# EasyEDA Pro project ST_Link_v2.1.eprj

# Schematic Schematic1
Create Date: 2023-06-13; Page Name: P1; Project Name: ST_Link_v2.1; Schematic Name: Schematic1; Update Date: 2023-06-21; Company: 嘉立创EDA; Page Size: A4; Version: V1.0
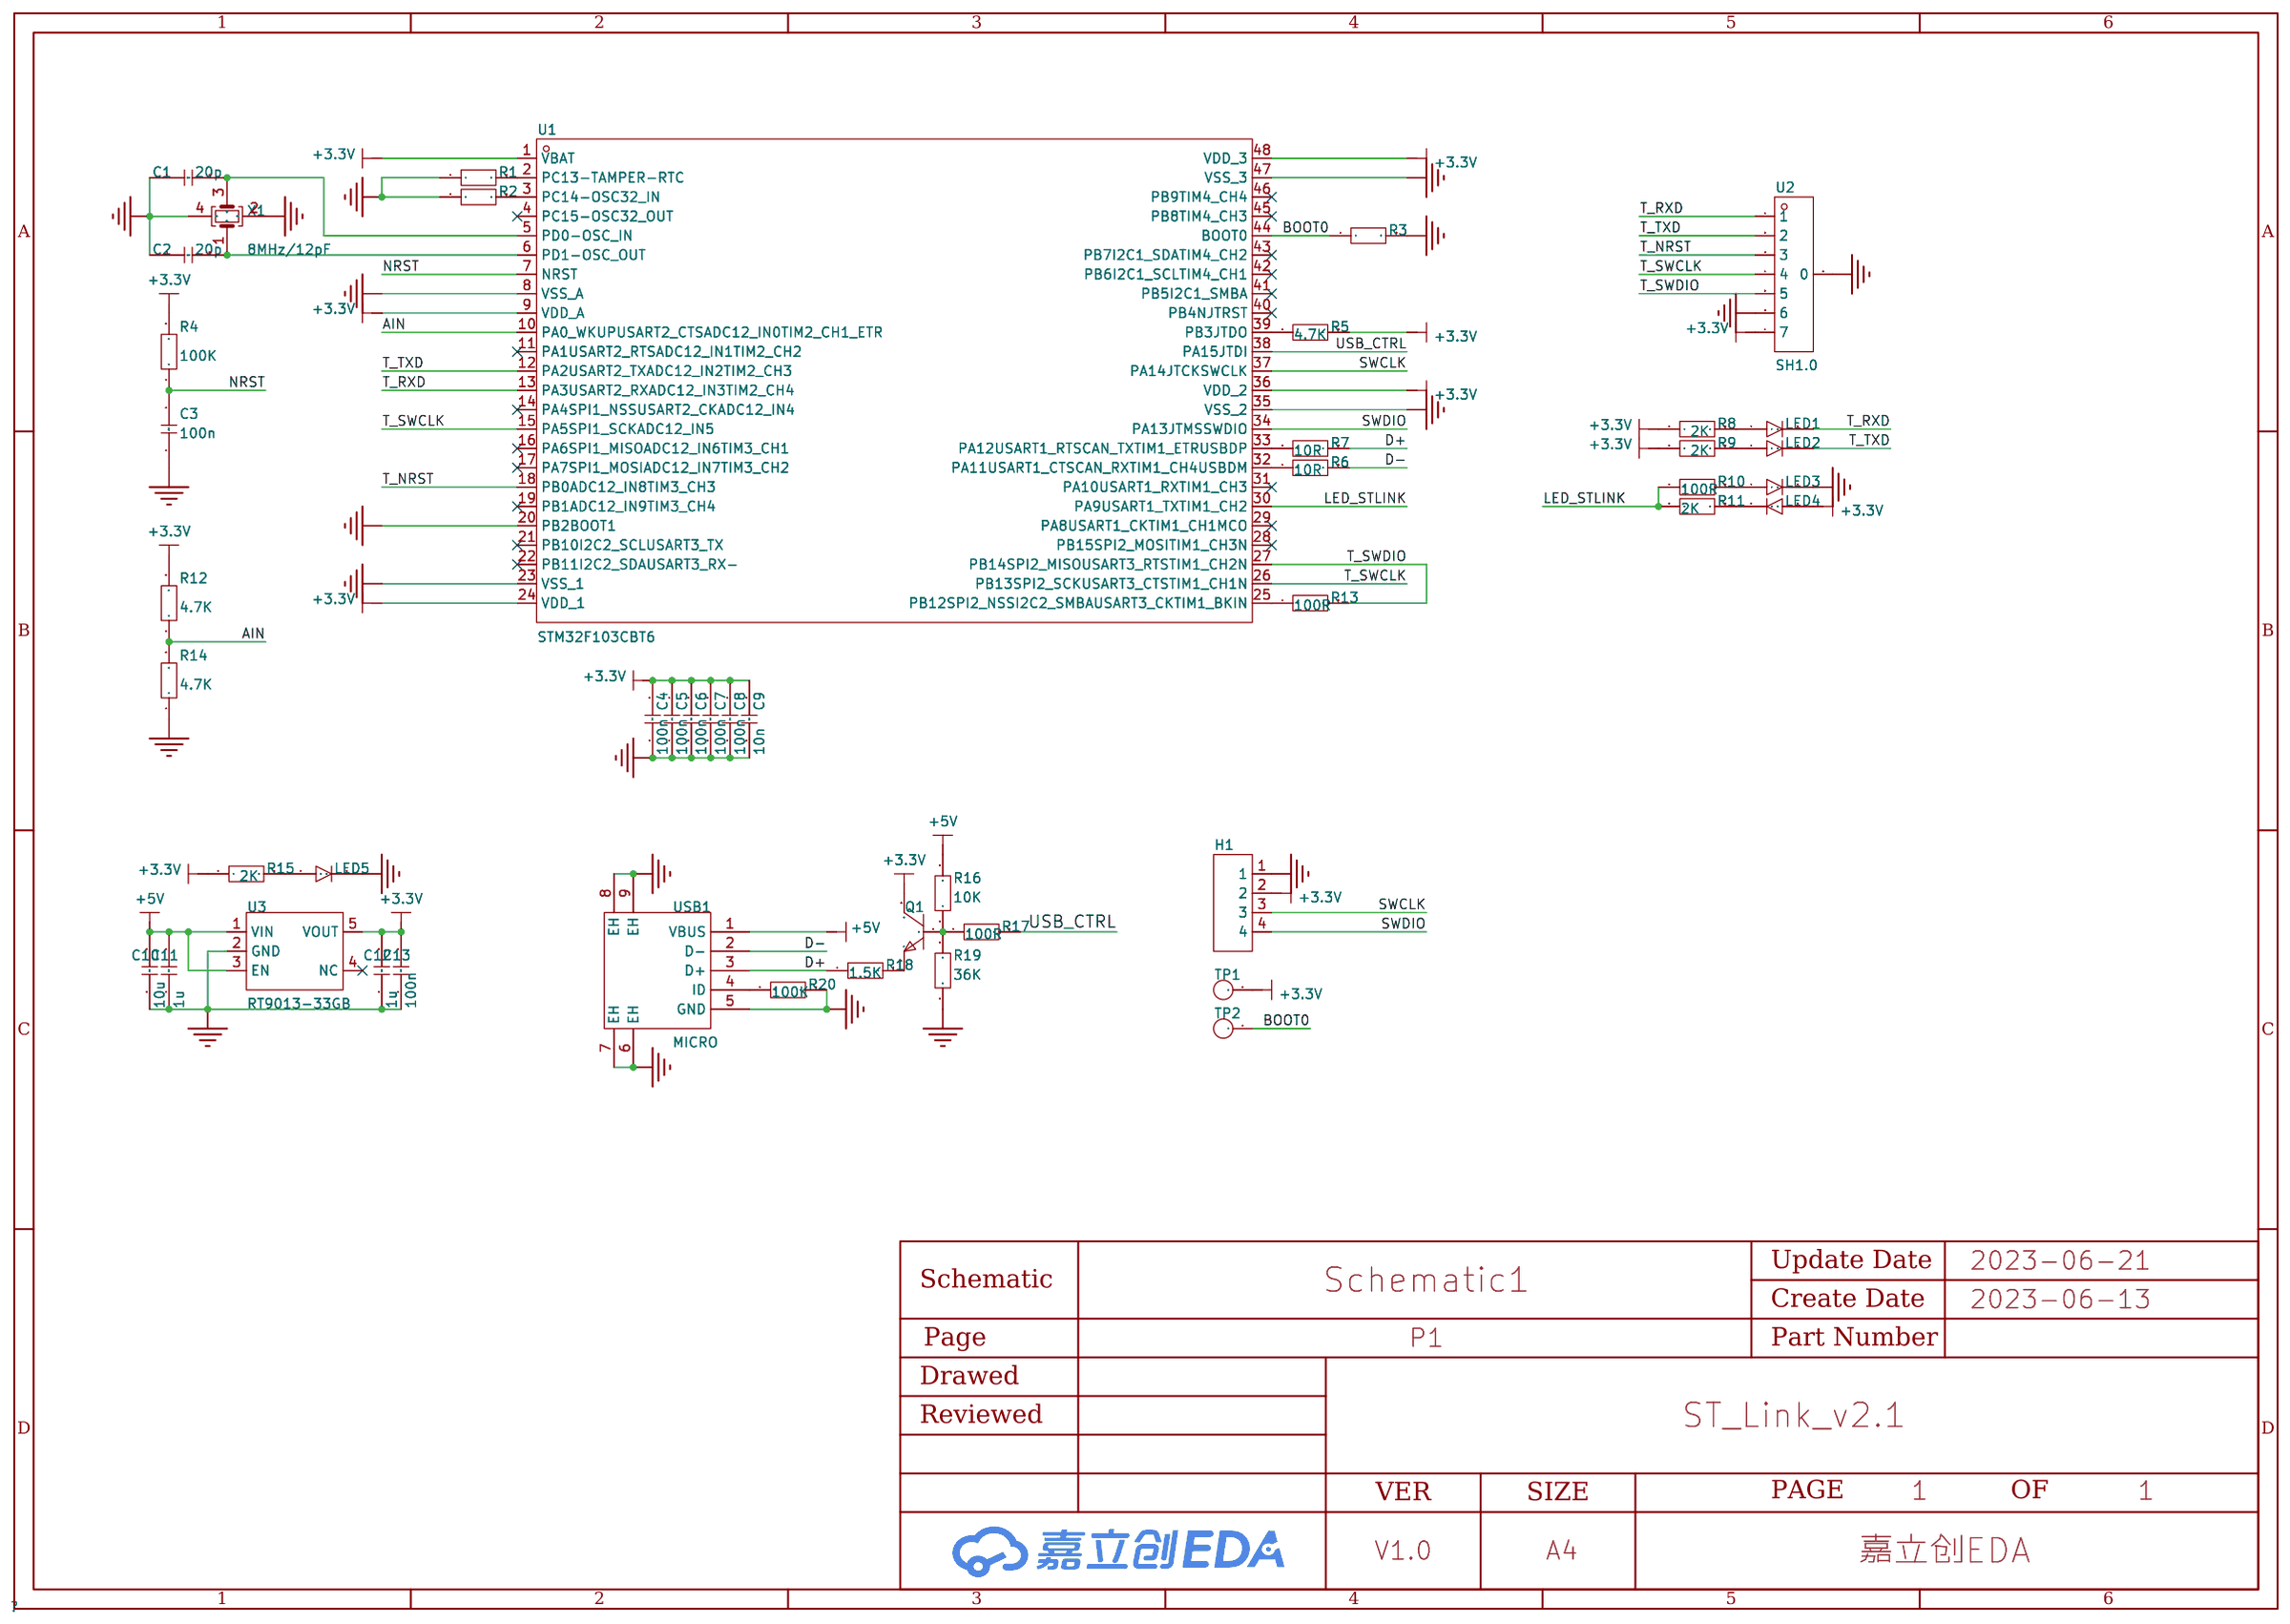
[diagram p0: schematic sheet]

## Parts
C1  20p  [C0402]
C2  20p  [C0402]
C3  100n  [C0402]
C4  100n  [C0402]
C5  100n  [C0402]
C6  100n  [C0402]
C7  100n  [C0402]
C8  100n  [C0402]
C9  10n  [C0402]
C10  10u  [C0402]
C11  1u  [C0402]
C12  1u  [C0402]
C13  100n  [C0402]
H1  -  [PIN_1.27_1x4]
LED1  red  [LED0402]
LED2  green  [LED0402]
LED3  red  [LED0402]
LED4  green  [LED0402]
LED5  red  [LED0402]
Q1  -  [S8050_SOT-23]
R1  10K  [R0402]
R2  10K  [R0402]
R3  10K  [R0402]
R4  100K  [R0402]
R5  4.7K  [R0402]
R6  10R  [R0402]
R7  10R  [R0402]
R8  2K  [R0402]
R9  2K  [R0402]
R10  100R  [R0402]
R11  2K  [R0402]
R12  4.7K  [R0402]
R13  100R  [R0402]
R14  4.7K  [R0402]
R15  2K  [R0402]
R16  10K  [R0402]
R17  100R  [R0402]
R18  1.5K  [R0402]
R19  36K  [R0402]
R20  100K  [R0402]
TP1  -  [TP-1.27]
TP2  -  [TP-1.27]
U1  STM32F103CBT6  [LQFP-48_L7.0-W7.0-P0.50-LS9.0-BL]
U2  SH1.0  [CONN-SMD_7P-SH1.00-7P-WT]
U3  RT9013-33GB  [SOT-23-5_L3.0-W1.7-P0.95-LS2.8-BL]
USB1  MICRO  [MICRO-USB-SMD_KH-MICRO-SMT.J7.2-5P]
X1  8MHz/12pF  [OSC-SMD_4P-L3.2-W2.5-BL]

## Library data of the parts
C1-C13 = C0402
H1 = PIN_1.27_1x4
LED1 LED3 LED5 = LED-R-0402
LED2 LED4 = LED-G-0402
Q1 = S8050_SOT_NPN: Supplier Footprint: SOT-23
R1-R20 = R0402
TP1 TP2 = TP-1.27: JLCPCB Part Class: 扩展库
U1 = STM32F103CBT6: LCSC Part Name: ARM Cortex-M3 72MHz; Supplier Part: C8304; Manufacturer: ST(意法半导体); Supplier Footprint: LQFP-48(7x7); JLCPCB Part Class: 扩展库; Datasheet: https://atta.szlcsc.com/upload/public/pdf/source/20140724/1457707170379.pdf; Supplier: LCSC; CPU Core: ARM Cortex-M3; CPU Maximum Speed: 72MHz; Operating Voltage Range: 2V~3.6V; Program Storage Size: 128KB; Program Memory Type: FLASH; RAM Size: 20KB; GPIO Ports Number: 37; ADC (Bit): 12bit; Universal Serial Bus: 有; Peripheral/Function: DMA；片载温度传感器；PWM; Watchdog: 有; Infrared Data Association: 有; Low-Voltage Detect: 有; Direct Memory Access: 有; Internal Oscillator: 有; Operating Temperature Range: -40℃~+85℃
U2 = SH1.0_7P
U3 = RT9013-33GB: 输出类型:固定;输出极性:正;最大输入电压:5.5V;输出电压:3.3V;输出电流:500mA;电源纹波抑制比(PSRR):50dB@(10kHz);; Supplier Part: C47773; Manufacturer: RICHTEK(立锜); Supplier Footprint: SOT-23-5; JLCPCB Part Class: 扩展库; Datasheet: https://atta.szlcsc.com/upload/public/pdf/source/20150504/1457707282459.pdf; Supplier: LCSC; Output Type: 固定; Output Polarity: 正; Number of Outputs: 1; Maximum Input Voltage: 5.5V; Output Voltage: 3.3V; Dropout Voltage: 400mV@(500mA); Output Current: 500mA; Power Supply Rejection Ratio (PSRR): 50dB@(10kHz)
USB1 = KH-MICRO-SMT.J7.2-5P: 连接器类型:Micro-B;标准:USB 2.0;公母:母座;触点数量:5;端口数量:1;安装方式:卧贴;额定电流 - 电源:1A;工作温度范围:-30℃~+80℃;; LCSC Part Name: Micro-B 母座 卧贴; Supplier Part: C2688801; Manufacturer: kinghelm(金航标); Supplier Footprint: SMD; JLCPCB Part Class: 扩展库; Datasheet: https://atta.szlcsc.com/upload/public/pdf/source/20210202/C2688801_229287E4F6FB01E5C7708C9D4F7A0145.pdf; Supplier: LCSC; Connector Type: Micro-B; Standard: USB 2.0; Gender: 母座; Number of Contacts: 5; Number of Ports: 1; Mounting Style: 卧贴; Current Rating - Power (Max): 1A; Operating Temperature Range: -30℃~+80℃
X1 = OSC3225: LCSC Part Name: 16MHz ±10ppm 9pF YSX321SL; Supplier Part: C13738; Manufacturer: YXC(扬兴晶振); Manufacturer Part: X322516MLB4SI; Supplier Footprint: SMD3225-4P; JLCPCB Part Class: 基础库; Datasheet: https://atta.szlcsc.com/upload/public/pdf/source/20210329/C112971_1F611BDC486E193C1706F6D8EB5AA189.pdf; Supplier: LCSC; Crystal Type: 贴片无源晶振; Frequency Tolerance: ±10ppm; Frequency Stability: ±30ppm; Load Capacitance: 9pF; Operating Temperature: -40℃~+85℃

## Nets
+3.3V: C4.2 C5.2 C6.2 C7.2 C8.2 C9.2 C12.2 C13.2 H1.2 LED4.1 Q1.3 R4.2 R5.2 R8.1 R9.1 R12.2 R15.1 TP1.1 U1.1(VBAT) U1.9(VDD_A) U1.24(VDD_1) U1.36(VDD_2) U1.48(VDD_3) U2.7 U3.5(VOUT)
+5V: C10.2 C11.2 R16.2 U3.1(VIN) U3.3(EN) USB1.1(VBUS)
GND: C1.1 C2.1 C3.1 C4.1 C5.1 C6.1 C7.1 C8.1 C9.1 C10.1 C11.1 C12.1 C13.1 H1.1 LED3.2 LED5.2 R1.1 R2.1 R3.2 R14.1 R19.1 R20.2 U1.8(VSS_A) U1.20(PB2BOOT1) U1.23(VSS_1) U1.35(VSS_2) U1.47(VSS_3) U2.0 U2.6 U3.2(GND) USB1.5(GND) USB1.6(EH) USB1.7(EH) USB1.8(EH) USB1.9(EH) X1.2(GND) X1.4(GND)
AIN: R12.1 R14.2 U1.10(PA0_WKUPUSART2_CTSADC12_IN0TIM2_CH1_ETR)
BOOT0: R3.1 TP2.1 U1.44(BOOT0)
D+: R7.2 R18.1 USB1.3(D+)
D-: R6.2 USB1.2(D-)
LED_STLINK: R10.1 R11.1 U1.30(PA9USART1_TXTIM1_CH2)
NRST: C3.2 R4.1 U1.7(NRST)
SWCLK: H1.3 U1.37(PA14JTCKSWCLK)
SWDIO: H1.4 U1.34(PA13JTMSSWDIO)
T_NRST: U1.18(PB0ADC12_IN8TIM3_CH3) U2.3
T_RXD: LED1.2 U1.13(PA3USART2_RXADC12_IN3TIM2_CH4) U2.1
T_SWCLK: U1.15(PA5SPI1_SCKADC12_IN5) U1.26(PB13SPI2_SCKUSART3_CTSTIM1_CH1N) U2.4
T_SWDIO: R13.2 U1.27(PB14SPI2_MISOUSART3_RTSTIM1_CH2N) U2.5
T_TXD: LED2.2 U1.12(PA2USART2_TXADC12_IN2TIM2_CH3) U2.2
USB_CTRL: R17.2 U1.38(PA15JTDI)
$1N2460: R1.2 U1.2(PC13-TAMPER-RTC)
$1N2527: R2.2 U1.3(PC14-OSC32_IN)
$1N4431: C1.2 U1.5(PD0-OSC_IN) X1.3(OSC2)
$1N4445: C2.2 U1.6(PD1-OSC_OUT) X1.1(OSC1)
$1N5071: R13.1 U1.25(PB12SPI2_NSSI2C2_SMBAUSART3_CKTIM1_BKIN)
$1N5297: R6.1 U1.32(PA11USART1_CTSCAN_RXTIM1_CH4USBDM)
$1N5356: R7.1 U1.33(PA12USART1_RTSCAN_TXTIM1_ETRUSBDP)
$1N6163: R5.1 U1.39(PB3JTDO)
$1N9264: Q1.2 R18.2
$1N9333: Q1.1 R16.1 R17.1 R19.2
$1N10341: R20.1 USB1.4(ID)
$1N11256: LED1.1 R8.2
$1N11591: LED5.1 R15.2
$1N16479: LED3.1 R10.2
$1N17806: LED4.2 R11.2
$1N18701: LED2.1 R9.2

Not connected (* = marked no-connect by the designer): U1 4(PC15-OSC32_OUT)* 11(PA1USART2_RTSADC12_IN1TIM2_CH2)* 14(PA4SPI1_NSSUSART2_CKADC12_IN4)* 16(PA6SPI1_MISOADC12_IN6TIM3_CH1)* 17(PA7SPI1_MOSIADC12_IN7TIM3_CH2)* 19(PB1ADC12_IN9TIM3_CH4)* 21(PB10I2C2_SCLUSART3_TX)* 22(PB11I2C2_SDAUSART3_RX-)* 28(PB15SPI2_MOSITIM1_CH3N)* 29(PA8USART1_CKTIM1_CH1MCO)* 31(PA10USART1_RXTIM1_CH3)* 40(PB4NJTRST)* 41(PB5I2C1_SMBA)* 42(PB6I2C1_SCLTIM4_CH1)* 43(PB7I2C1_SDATIM4_CH2)* 45(PB8TIM4_CH3)* 46(PB9TIM4_CH4)*; U3 4(NC)*

# Board PCB1
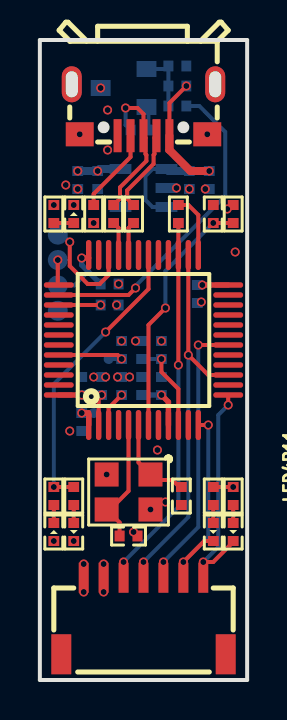
[diagram p1: board, top side]
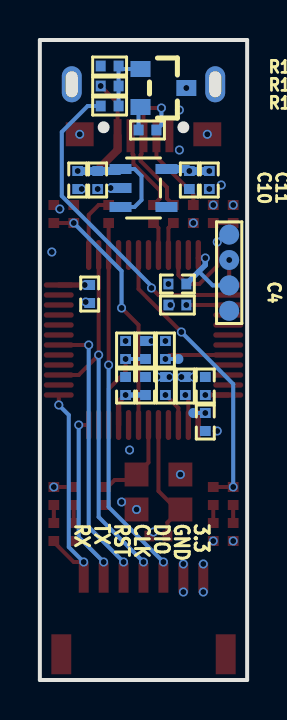
[diagram p2: board, bottom side, seen from below]

Outline 10.4 x 32 mm; copper layers: Top Layer, Inner1, Inner2, Bottom Layer. Coordinates in mm from the lower left corner of the outline.
Outline path: 0,32 10.4,32 10.4,0 0,0 0,32
Stack: Top Layer 0.035mm / Dielectric1 0.48mm PP er 4.5 / Inner1 0.035mm / Dielectric2 0.48mm FR4 er 4.5 / Inner2 0.035mm / Dielectric3 0.48mm PP er 4.5 / Bottom Layer 0.035mm

## Design rules (mm)
net D-: DP1
net D+: DP1
spacing safeClearance (default): track to track 0.152, other pairs 0.152 to 0.3
track width trackWidth (default): min 0.2, default 0.2, max 1
differential pair differentialPair (default): width min 0.2, default 0.2, max 0.2; gap min 0.16, default 0.16
via viaSize (default): diameter min 0.45, default 0.45, max 0.45; hole min 0.3, default 0.3, max 0.3

## Placement (name value [footprint] x y rotation side)
C1  20p  [C0402]  4.45 7.2 180 top
C2  20p  [C0402]  7.1 9.2 90 top
C3  100n  [C0402]  8.7 23.3 270 top
C4  100n  [C0402]  7.9 19.3 90 bottom
C5  100n  [C0402]  3.5 19.8 180 bottom
C6  100n  [C0402]  5.1 14.7 270 bottom
C7  100n  [C0402]  2.1 12.9 90 bottom
C8  100n  [C0402]  2.1 14.7 270 bottom
C9  10n  [C0402]  6.1 14.7 270 bottom
C10  10u  [C0402]  8.5 25 90 bottom
C11  1u  [C0402]  7.5 25 90 bottom
C12  1u  [C0402]  2.9 25 90 bottom
C13  100n  [C0402]  1.9 25 90 bottom
H1  -  [PIN_1.27_1x4]  0.9 20.36 90 bottom
LED1  red  [LED0402]  9.7 7.4 270 top
LED2  green  [LED0402]  8.7 7.4 270 top
LED3  red  [LED0402]  1.7 7.4 270 top
LED4  green  [LED0402]  0.7 7.4 90 top
LED5  red  [LED0402]  1.7 23.3 90 top
Q1  -  [S8050_SOT-23]  4.2 29.6 0 bottom
R1  10K  [R0402]  3.1 14.7 270 bottom
R2  10K  [R0402]  4.1 14.7 270 bottom
R3  10K  [R0402]  4.1 16.5 90 bottom
R4  100K  [R0402]  9.7 23.3 90 top
R5  4.7K  [R0402]  3.5 18.75 0 bottom
R6  10R  [R0402]  4.7 23.3 90 top
R7  10R  [R0402]  3.7 23.3 90 top
R8  2K  [R0402]  9.7 9.2 270 top
R9  2K  [R0402]  8.7 9.2 270 top
R10  100R  [R0402]  1.7 9.2 270 top
R11  2K  [R0402]  0.7 9.2 270 top
R12  4.7K  [R0402]  6.1 16.5 90 bottom
R13  100R  [R0402]  6.95 23.3 270 top
R14  4.7K  [R0402]  5.1 16.5 270 bottom
R15  2K  [R0402]  0.7 23.3 270 top
R16  10K  [R0402]  6.9 29.7 0 bottom
R17  100R  [R0402]  6.9 28.7 0 bottom
R18  1.5K  [R0402]  5 27.5 0 bottom
R19  36K  [R0402]  6.9 30.7 180 bottom
R20  100K  [R0402]  2.7 23.3 270 top
TP1  -  [tp-1.27]  2.7 13.35 180 bottom
TP2  -  [tp-1.27]  3.45 16.05 180 bottom
U1  STM32F103CBT6  [LQFP-48_L7.0-W7.0-P0.50-LS9.0-BL]  5.2 17 0 top
U2  SH1.0  [CONN-SMD_7P-SH1.00-7P-WT]  5.2 3.2 0 top
U3  RT9013-33GB  [SOT-23-5_L3.0-W1.7-P0.95-LS2.8-BL]  5.2 24.6 270 bottom
USB1  MICRO  [MICRO-USB-SMD_KH-MICRO-SMT.J7.2-5P]  5.2 28.5 180 top
X1  8MHz/12pF  [OSC-SMD_4P-L3.2-W2.5-BL]  4.45 9.4 180 top

## Footprints (pads in the part's own frame, mm; a bottom-side part is the same pattern mirrored in y, then rotated)
C0402
  rect 0.5x0.54 smd: 1(-0.45,0) 2(0.45,0)
CONN-SMD_7P-SH1.00-7P-WT
  rect 1x2 smd: 0(-4.125,-1.915) 0(4.125,-1.915)
  rect 0.5x1.5 smd: 1(3,1.915) 2(2,1.915) 3(1,1.915) 4(0,1.915) 5(-1,1.915) 6(-2,1.915) 7(-3,1.915)
LED0402
  rect 0.5x0.54 smd: 1(-0.45,0) 2(0.45,0)
LQFP-48_L7.0-W7.0-P0.50-LS9.0-BL
  oval 0.27x1.5 smd: 1(-2.75,-4.25) 2(-2.25,-4.25) 3(-1.75,-4.25) 4(-1.25,-4.25) 5(-0.75,-4.25) 6(-0.25,-4.25) 7(0.25,-4.25) 8(0.75,-4.25) 9(1.25,-4.25) 10(1.75,-4.25) 11(2.25,-4.25) 12(2.75,-4.25) 25(2.75,4.25) 26(2.25,4.25) 27(1.75,4.25) 28(1.25,4.25) 29(0.75,4.25) 30(0.25,4.25) 31(-0.25,4.25) 32(-0.75,4.25) 33(-1.25,4.25) 34(-1.75,4.25) 35(-2.25,4.25) 36(-2.75,4.25)
  oval 1.5x0.27 smd: 13(4.25,-2.75) 14(4.25,-2.25) 15(4.25,-1.75) 16(4.25,-1.25) 17(4.25,-0.75) 18(4.25,-0.25) 19(4.25,0.25) 20(4.25,0.75) 21(4.25,1.25) 22(4.25,1.75) 23(4.25,2.25) 24(4.25,2.75) 37(-4.25,2.75) 38(-4.25,2.25) 39(-4.25,1.75) 40(-4.25,1.25) 41(-4.25,0.75) 42(-4.25,0.25) 43(-4.25,-0.25) 44(-4.25,-0.75) 45(-4.25,-1.25) 46(-4.25,-1.75) 47(-4.25,-2.25) 48(-4.25,-2.75)
MICRO-USB-SMD_KH-MICRO-SMT.J7.2-5P
  rect 0.4x1.65 smd: 1(-1.3,1.286) 2(-0.65,1.286) 3(0,1.286) 4(0.65,1.286) 5(1.3,1.286)
  rect 1.4x1.2 smd: 6(-3.2,1.214) 9(3.2,1.214)
  oval 1x1.8 hole 0.6x1.3: 7(-3.6,-1.286) 8(3.6,-1.286)
OSC-SMD_4P-L3.2-W2.5-BL
  rect 1.2x1.2 smd: 1(-1.1,-0.875) 2(1.1,-0.875) 3(1.1,0.875) 4(-1.1,0.875)
PIN_1.27_1x4
  round 1 smd: 1(-1.905,0) 2(-0.635,0) 3(0.635,0) 4(1.905,0)
R0402
  rect 0.5x0.54 smd: 1(-0.45,0) 2(0.45,0)
S8050_SOT-23
  rect 1x0.8 smd: 1(1.15,-0.95) 2(1.15,0.95) 3(-1.15,0)
SOT-23-5_L3.0-W1.7-P0.95-LS2.8-BL
  rect 0.5x1.1 smd: 1(-0.95,-1.153) 2(0,-1.153) 3(0.95,-1.153) 4(0.95,1.153) 5(-0.95,1.153)
tp-1.27
  round 0.5 smd: 1(0,0)

## Nets
As in the schematic.

Pads without a net: U1 4 11 14 16 17 19 21 22 28 29 31 40 41 42 43 45 46; U3 4

## Via types
v1: diameter 0.45, hole 0.3, Top Layer to Bottom Layer, 70 vias

## Routing (per net, layer and track width the routed paths; a pad name or vN(x,y) marks a point on that pad's centre or on a via; arc(x,y) is an arc through that point)
+3.3V: length 13.6
  Top Layer w0.2: v1(9.7,9.65) R9.1
  Top Layer w0.27: v1(6.1,14.25) 6.45,13.9 U1.9 ; U1.24 v1(8.15,19.75) ; v1(2.1,14.25) U1.48 ; v1(2.1,21.1) 2.45,21.1 ; U1.1 2.45,13.25 2.35,13.35 v1(2.1,13.35)
  Bottom Layer w0.2: H1.2 1.73,19.73 2.42,20.42 ; v1(2.1,13.35) TP1.1
  Bottom Layer w0.27: v1(2.1,21.1) 2.1,20.75 C5.2 ; C6.2 v1(6.1,14.25)
  Bottom Layer w0.4: v1(1.9,25.45) v1(2.9,25.45) 3,25.55 U3.5
  vias: v1(0.7,23.75) v1(0.7,6.95) v1(2.2,5.8) v1(2.2,4.4) v1(3.05,29.6) v1(3.85,18.75) v1(6.1,16.95) v1(9.4,23.55)
+5V: length 11.8
  Top Layer w0.2: v1(7.35,29.7) 6.5,28.85 USB1.1
  Top Layer w0.4: v1(8.5,25.45) 7.55,25.45 6.5,26.5 USB1.1
  Bottom Layer w0.2: U3.1 5.65,25.55 5.3,25.2 5.3,24 5.65,23.65 U3.3
  Bottom Layer w0.4: U3.1 6.45,25.45 C11.2 v1(8.5,25.45)
GND:
  vias: v1(1.3,24.75) v1(1.5,12.45) v1(1.7,23.75) v1(1.7,6.95) v1(1.9,24.55) v1(2,27.29) v1(2.7,22.85) v1(2.7,15.15) v1(3.2,5.8) v1(3.2,4.4) v1(3.3,15.15) v1(3.4,28.5) v1(3.4,26.5) v1(3.35,10.28) v1(3.9,15.15) v1(3.95,19.8) v1(4.1,16.95) v1(4.5,15.15) v1(4.7,7.4) v1(4.8,16.95) v1(5.55,8.53) v1(5.9,11.5) v1(6.3,8.9) v1(6.85,24.6) v1(7.5,24.55) v1(8.1,18.9) v1(8.3,24.55) v1(8.4,27.29) v1(9.8,21.4)
AIN: length 4.7
  Top Layer w0.2: U1.10 6.95,14.55 6.1,15.4 v1(6.1,16.05)
  Bottom Layer w0.2: v1(6.1,16.05) R14.2
BOOT0: length 3.9
  Top Layer w0.2: v1(4.1,16.05) 3.9,16.25 U1.44
  Bottom Layer w0.2: TP2.1 v1(4.1,16.05)
D+: length 7.5
  Top Layer w0.2: R7.2 4.02,24.07 4.02,24.63 5.34,25.95 5.34,26.25 5.3,26.3 5.3,27.11 USB1.3 5.2,28.3 4.9,28.6 v1(4.3,28.6)
  Bottom Layer w0.2: v1(4.3,28.6) 4.3,27.75 R18.1
D-: length 4.2
  Top Layer w0.2: USB1.2 5.75,27.11 5.75,26.3 5.7,26.25 5.7,25.81 4.38,24.48 4.38,24.07 R6.2
LED_STLINK: length 14.6
  Top Layer w0.2: v1(0.7,9.65) R10.1 ; v1(3.3,17.4) 5.45,19.55 U1.30
  Bottom Layer w0.2: v1(3.3,17.4) 0.7,14.8 v1(0.7,9.65)
NRST: length 12.4
  Top Layer w0.2: v1(8.7,22.85) R4.1 ; v1(6.3,18.6) 5.45,17.75 U1.7
  Bottom Layer w0.2: v1(8.7,22.85) 6.3,20.45 v1(6.3,18.6)
SWCLK: length 1.3
  Top Layer w0.2: v1(0.9,21) 0.9,19.8 U1.37
SWDIO: length 5.5
  Top Layer w0.2: U1.34 3.45,20.25 3,19.8 2.4,19.8 1.5,20.7 v1(1.5,21.9)
  Bottom Layer w0.2: H1.4 1.13,22.27 v1(1.5,21.9)
T_NRST: length 13.1
  Top Layer w0.2: U1.18 v1(7.95,16.75)
  Bottom Layer w0.2: v1(7.95,16.75) 7.95,7.65 v1(6.2,5.9)
T_RXD: length 10.8
  Top Layer w0.2: v1(8.2,5.9) 8.7,5.9 9.7,6.9 LED1.2 ; v1(9.45,13.75) U1.13
  Bottom Layer w0.2: v1(9.45,13.75) 8.95,13.25 8.95,6.65 v1(8.2,5.9)
T_SWCLK: length 18.7
  Top Layer w0.2: U1.15 8.45,15.25 v1(7.45,16.25) U1.26
  Bottom Layer w0.2: v1(5.2,5.9) 7.45,8.15 v1(7.45,16.25)
T_SWDIO: length 18.1
  Top Layer w0.2: R13.2 U1.27 v1(6.95,15.75)
  Bottom Layer w0.2: v1(6.95,15.75) 6.95,8.65 v1(4.2,5.9)
T_TXD: length 9.8
  Top Layer w0.2: v1(7.2,5.9) 8.25,6.95 LED2.2 ; v1(8.45,12.75) U1.12
  Bottom Layer w0.2: 7.18,5.88 v1(7.2,5.9) 8.45,7.15 v1(8.45,12.75)
USB_CTRL: length 16.1
  Top Layer w0.2: v1(4.8,19.6) 4.45,19.25 U1.38
  Bottom Layer w0.2: R17.2 8,28.7 9.3,27.4 9.3,24.2 4.8,19.7 v1(4.8,19.6)
$1N2460: length 1.6
  Top Layer w0.2: v1(3.1,14.25) 2.95,14.1 U1.2
$1N2527: length 1.8
  Top Layer w0.2: v1(4.1,14.25) 3.45,13.6 U1.3
$1N4431: length 6.4
  Top Layer w0.2: U1.5 4.45,9.45 3.52,8.53 X1.3 4,7.88 C1.2
$1N4445: length 4.4
  Top Layer w0.2: 7,9.65 6.65,10 5.82,10 X1.1 4.95,10.88 U1.6
$1N5071: length 3.2
  Top Layer w0.2: U1.25 7.95,23.25 7.45,23.75 R13.1
$1N5297: length 1.7
  Top Layer w0.2: R6.1 4.45,22.6 U1.32
$1N5356: length 1.7
  Top Layer w0.2: R7.1 3.95,22.6 U1.33
$1N6163: length 2.1
  Top Layer w0.2: v1(3.05,18.75) U1.39
$1N9264: length 1.2
  Bottom Layer w0.2: R18.2 5.45,28.55 Q1.2
$1N9333: length 3.2
  Bottom Layer w0.2: R17.1 R16.1 R19.2 6.3,30.55 Q1.1
$1N10341: length 4.2
  Top Layer w0.2: USB1.4 4.55,26.15 2.7,24.3 R20.1
$1N11256: length 0.9
  Top Layer w0.2: R8.2 LED1.1
$1N11591: length 1
  Top Layer w0.2: R15.2 LED5.1
$1N16479: length 0.9
  Top Layer w0.2: R10.2 LED3.1
$1N17806: length 0.9
  Top Layer w0.2: LED4.2 R11.2
$1N18701: length 0.9
  Top Layer w0.2: R9.2 LED2.1

## Copper pours and planes (outline as drawn; the poured copper is in the pictures)
+3.3V on Inner2: 0.25,31.75 10.15,31.75 10.15,0.25 0.25,0.25
GND on Top Layer: 0,32 10.4,32 10.4,0 0,0
GND on Bottom Layer: 0,32 10.4,32 10.4,0 0,0
GND on Inner1: 0.25,31.75 10.15,31.75 10.15,0.25 0.25,0.25

## Text on the board
Bottom Silkscreen Layer: 3.3 | GND | DIO | CLK | RST | TX | RX
